# Altium schematic sheet 04_POWER.SchDoc: =TitleParameter
size A3; Project: HW_RYP_RADAR_R3; Organization: ASISGUARD; Address1: Kemalpasa, Kemalpasa Cd. No:290 D:292H, 35060 Bornova/Izmir/Turkey; SheetNumber: 4; SheetTotal: 8
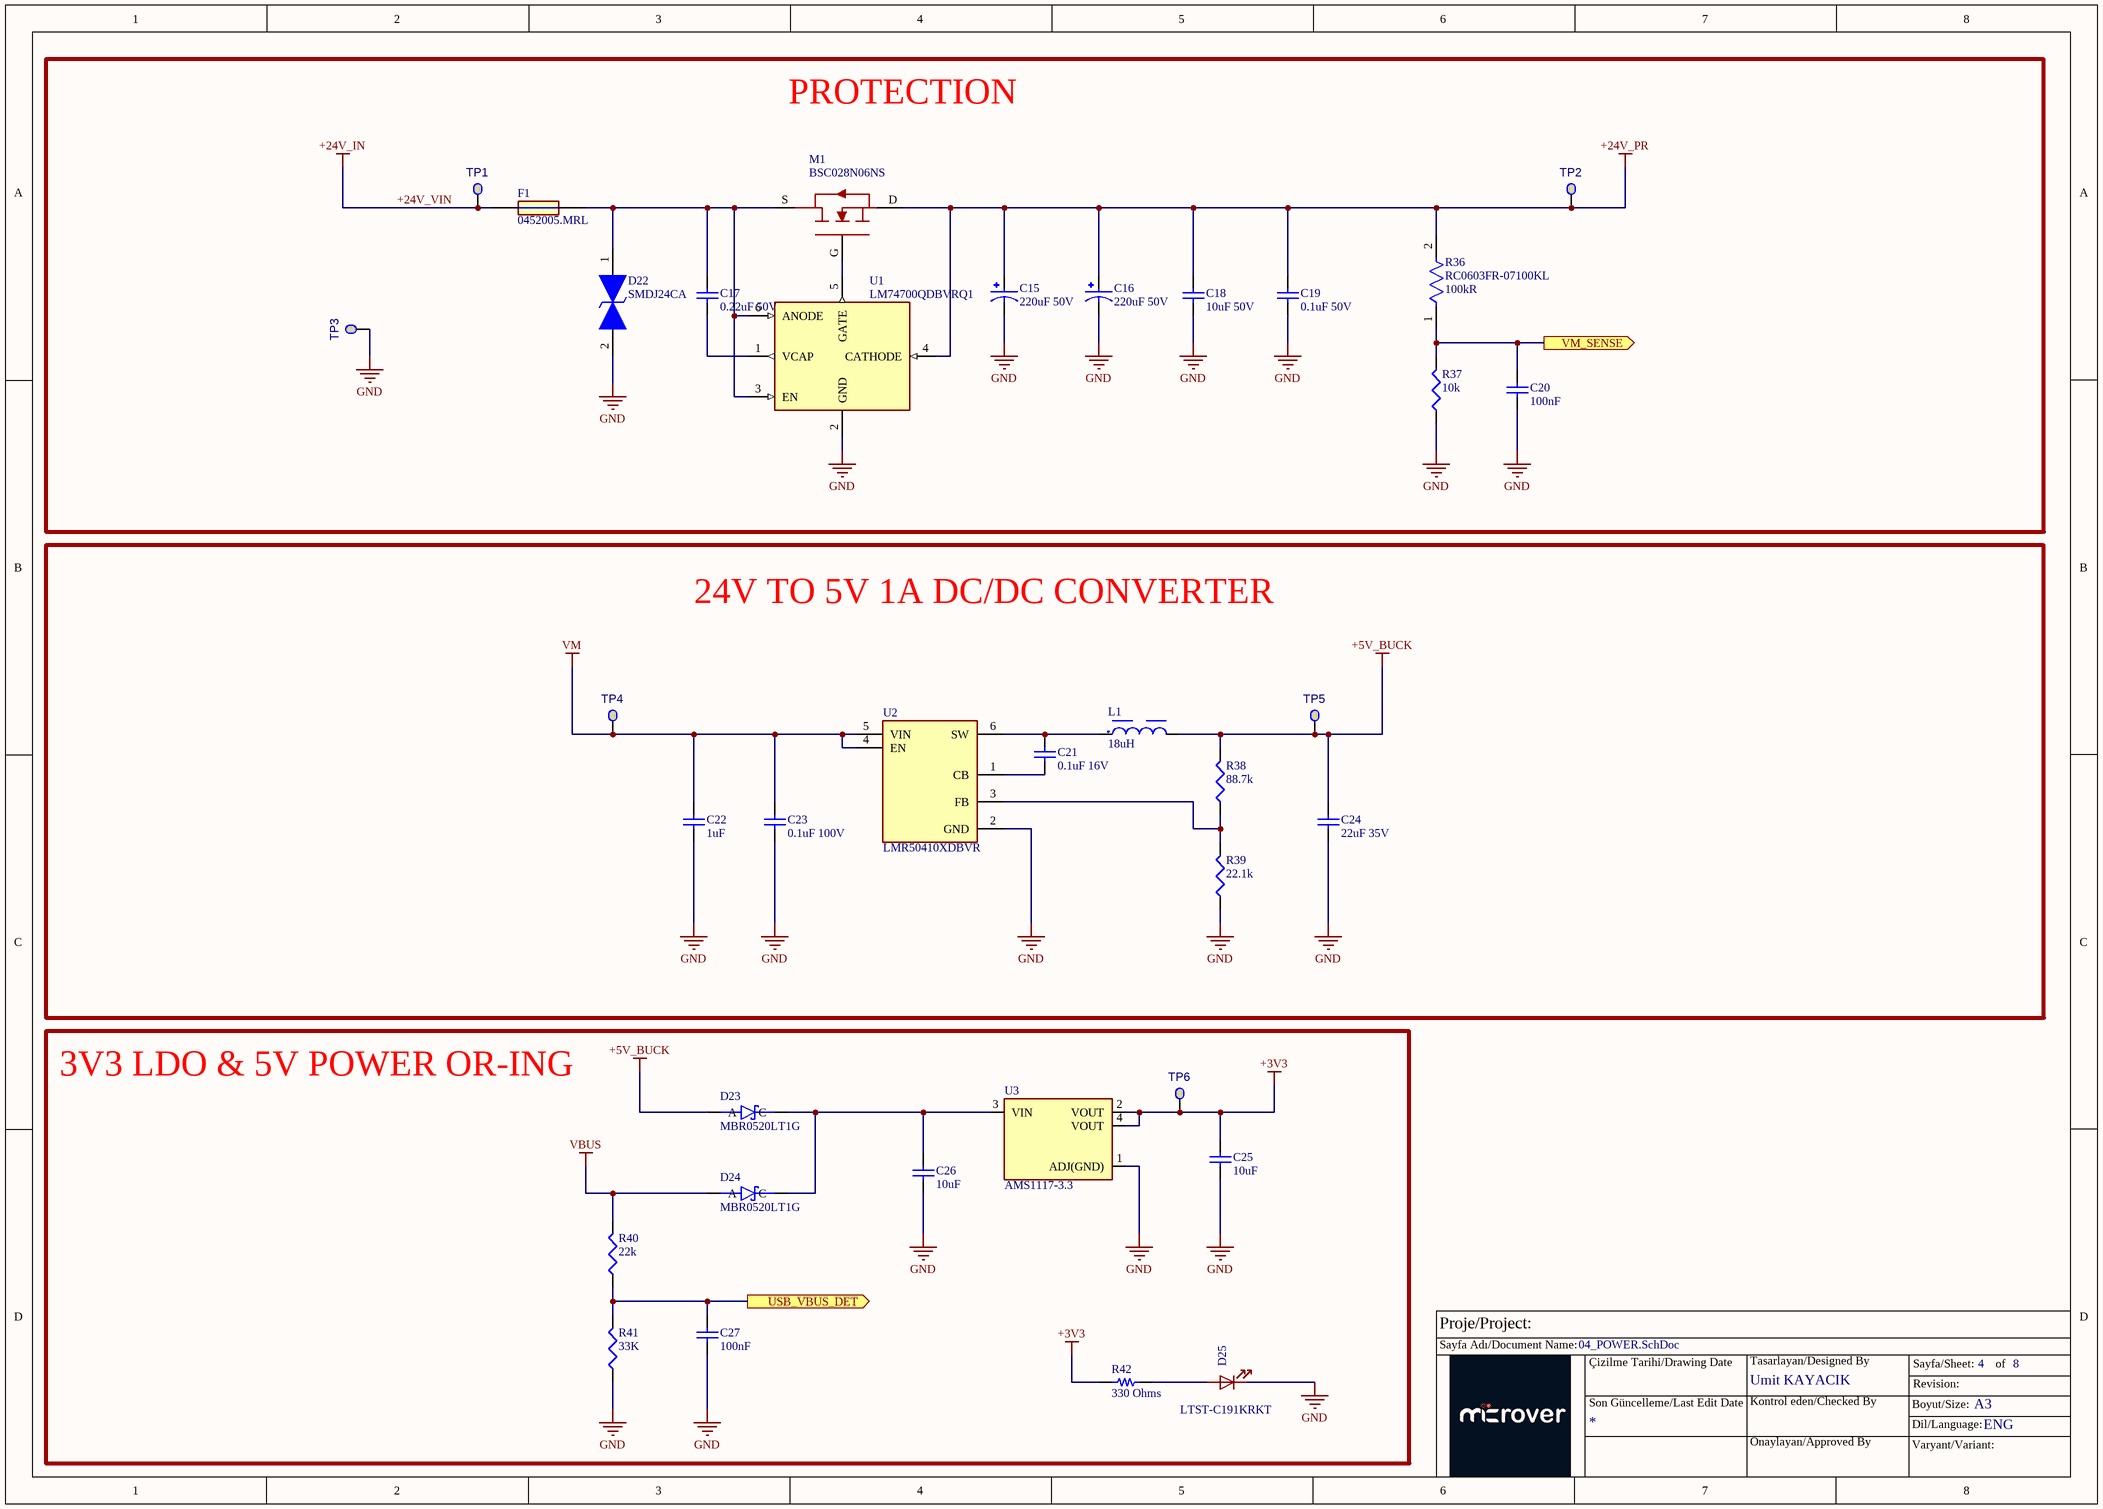
[diagram p0: 04_POWER.SchDoc]

## Parts
C15  220uF 50V  [CAP_EEEFT1H221AV]
C16  220uF 50V  [CAP_EEEFT1H221AV]
C17  value 0.22uF 50V  [SMC0603]  (hidden comment: CAP CER 0.22UF 50V X7R 0603)
C18  value 10uF 50V  [SMC1206]  (hidden comment: CAP CER 10UF 50V X5R 1206)
C19  value 0.1uF 50V  [SMC0603]  (hidden comment: CAP CER 0.1UF 50V X7R 0603)
C20  value 100nF  [CAP0603]  (hidden comment: 100nF 25V)
C21  0.1uF 16V  [CAP0603]
C22  1uF  [CAP0603]
C23  0.1uF 100V  [CAP0603]
C24  22uF 35V  [CAP1206]
C25  10uF  [CAP0603]
C26  10uF  [CAP0603]
C27  value 100nF  [CAP0603]  (hidden comment: 100nF 25V)
D22  SMDJ24CA  [DIONM9059X262N]
D23  MBR0520LT1G  [SOD3716X135N]
D24  MBR0520LT1G  [SOD3716X135N]
D25  LTST-C191KRKT  [LED0603]
F1  0452005.MRL  [FUSC6127X294N]
L1  18uH  [WE-LQS_6045]
M1  BSC028N06NS  [BSC028N06NS]
R36  RC0603FR-07100KL  Resistance: 100kR  [FP-RC0603-0_55-MFG]
R37  value 10k  [RES0603]  (hidden comment: RES 10K OHM 1% 1/8W 0603)
R38  88.7k  [RES0603]
R39  22.1k  [RES0603]
R40  value 22k  [SMR0603]  (hidden comment: RES 22K OHM 1% 1/10W 0603)
R41  value 33K  [SMR0603]  (hidden comment: RES 33K OHM 1% 1/10W 0603)
R42  330 Ohms  [RES 0603_1608]
TP1  Testpoint  [SMD_Ø1.5mm]  (value not drawn)  (no BOM)
TP2  Testpoint  [SMD_Ø1.5mm]  (value not drawn)  (no BOM)
TP3  Testpoint  [SMD_Ø1.5mm]  (value not drawn)  (no BOM)
TP4  Testpoint  [SMD_Ø1.5mm]  (value not drawn)  (no BOM)
TP5  Testpoint  [SMD_Ø1.5mm]  (value not drawn)  (no BOM)
TP6  Testpoint  [SMD_Ø1.5mm]  (value not drawn)  (no BOM)
U1  LM74700QDBVRQ1  [SOT95P280X145-6N/LM74700QDBVRQ1]
U2  LMR50410XDBVR  [SOT95P280X145-6N/]
U3  AMS1117-3.3  [SOT-223-4_L6.5-W3.5-P2.30-LS7.0-BR]

## Blocks framed on the sheet
PROTECTION: C15-C20 D22 F1 M1 R36 R37 TP1-TP3 U1
24V TO 5V 1A DC/DC CONVERTER: C21-C24 L1 R38 R39 TP4 TP5 U2
3V3 LDO & 5V POWER OR-ING: C25-C27 D23-D25 R40-R42 TP6 U3

## Ports
USB_VBUS_DET (out), VM_SENSE (out)

## Nets
+3V3: C25.2 R42.1 TP6.1(P1) U3.2(VOUT) U3.4(VOUT)
+5V_BUCK: C24.2 D23.A L1.2 R38.2 TP5.1(P1)
+24V_PR: C15.1 C16.1 C18.2 C19.2 M1.D R36.2 TP2.1(P1) U1.4(CATHODE)
+24V_VIN: F1.1 TP1.1(P1)  [also labelled +24V_IN]
GND: C15.2 C16.2 C18.1 C19.1 C20.1 C22.1 C23.1 C24.1 C25.1 C26.1 C27.1 D22.2 D25.2(K) R37.1 R39.1 R41.1 TP3.1(P1) U1.2(GND) U2.2(GND) U3.1(ADJ(GND))
VBUS: D24.A R40.2
VM: C22.2 C23.2 TP4.1(P1) U2.4(EN) U2.5(VIN)
USB_VBUS_DET: C27.2 R40.1 R41.2 ; port USB_VBUS_DET
VM_SENSE: C20.2 R36.1 R37.2 ; port VM_SENSE
NetC17_1: C17.1 U1.1(VCAP)
NetC17_2: C17.2 D22.1 F1.2 M1.S U1.3(EN) U1.6(ANODE)
NetC21_1: C21.1 U2.1(CB)
NetC21_2: C21.2 L1.1 U2.6(SW)
NetC26_2: C26.2 D23.C D24.C U3.3(VIN)
NetD25_1: D25.1(A) R42.2
NetM1_G: M1.G U1.5(GATE)
NetR38_1: R38.1 R39.2 U2.3(FB)

## Notes on the sheet
- Proje/Project:
- Sayfa Adı/Document Name:
- Çizilme Tarihi/Drawing Date
- Umit KAYACIK
- Tasarlayan/Designed By
- Sayfa/Sheet:
- Revision:
- of
- Son Güncelleme/Last Edit Date
- Kontrol eden/Checked By
- Onaylayan/Approved By
- Boyut/Size:
- Varyant/Variant:
- Dil/Language:
- A3
- ENG

## Library data of the parts
C15 C16 = EEEFT1H221AV: 220 µF 50 V Aluminum Electrolytic Capacitors Radial, Can - SMD 180mOhm @ 100kHz 2000 Hrs @ 105°C; Manufacturer Part Number: EEE-FT1H221AV; MF: Panasonic Electronic Components; Package: RADIAL-2 Panasonic; Price: None; Availability: In Stock; Value: *; Check_prices: https://www.snapeda.com/parts/EEE-FT1H221AV/Panasonic/view-part/5517810/?ref=eda; SnapEDA_Link: https://www.snapeda.com/parts/EEE-FT1H221AV/Panasonic/view-part/5517810/?ref=snap
C17 = CAP0603_0.22UF_50V: 0.22 µF ±10% 50V Ceramic Capacitor X7R 0603 (1608 Metric); Manufacturer Part Number: GCM188R71H224KA64D; Order Code: DIGI: 490-5402-2-ND
C18 = CAP1206_10UF_50V: 10 µF ±10% 50V Ceramic Capacitor X5R 1206 (3216 Metric); Manufacturer Part Number: CL31A106KBHNNNE; Order Code: Digi: 1276-2876-2-ND; Sirius Stock Code: *; LCSC Part Number: C13585; LCSC Manufacturer Part Number: CL31A106KBHNNNE
C19 = CAP0603_0.1UF_50V_2: 0.1 µF ±10% 50V Ceramic Capacitor X7R 0603 (1608 Metric); Manufacturer Part Number: CL10B104KB8NNNL; LCSC Manufacturer Part Number: CL10B104KB8NNNC; Order Code: DIGI:1276-CL10B104KB8NNNLTR-ND; Sirius Stock Code: A063-AGC10300001226; LCSC Part Number: C1591
C20 C27 = CAP0603_100nF: 0.1 µF ±10% 50V Ceramic Capacitor X7R 0603 (1608 Metric); Manufacturer Part Number: CL10B104KA8NNNC; LCSC Part Number: C1590
C21 = C0603C104M4RACTU: 0.1 µF ±20% 16V Ceramic Capacitor X7R 0603 (1608 Metric); Manifacturer: KEMET; Supplier: Digi; 399-C0603C104M4RACTUDKR-ND
C22 = MSASU168SB5105MTNA01: CAP CER 1UF 50V X5R 0603; Manufacturer: Taiyo Yuden; Supplier: 587-MSASU168SB5105MTNA01DKR-ND
C23 = GRM188R72A104KA35D: CAP CER 0.1UF 100V X7R 0603; Manifacturer: Murata Electronics; Supplier: Digi; 490-3285-6-ND
C24 = CAP1206_22uF_35V: 22 µF ±20% 35V Ceramic Capacitor X5R 1206 (3216 Metric); Manufacturer Part Number: C3216X5R1V226M160AC; Order Code: DIGI : 445-180362-1-ND; Value: 22uF 35V
C25 C26 = CAP0603_10uF_25V: 10 µF ±10% 25V Ceramic Capacitor X5R 0603 (1608 Metric); Manufacturer Part Number: GRM188R61E106KA73J; Order Code: Digi; 490-GRM188R61E106KA73JDKR-ND; Value: 10uF
D22 = SMDJ24CA: 38.9V Clamp 77.1A Ipp Tvs Diode Surface Mount DO-214AB (SMCJ); Manufacturer: Littelfuse Inc.; MPN: SMDJ24CA
D23 D24 = MBR0520LT1G: Diode 20 V 500mA Surface Mount SOD-123
D25 = LED_1: LED RED CLEAR SMD; Manufacturer: Lite-On Inc.; Value: LTST-C191KRKT; Footprint: LED_SMD:LED_0603_1608Metric; Manufacturer Part Number: LTST-C191KRKT; Supplier Part Number: 160-1447-1-ND
F1 = 0452005.MRL: FUSE BRD MNT 5A 125VAC/VDC 2SMD; Manufacturer: Littelfuse; Supplier: Digi; F2607DKR-ND
L1 = 74404064180: 18 µH Semi-Shielded Drum Core, Wirewound Inductor 2.2 A 81mOhm Nonstandard; Supplier: 732-5553-6-ND
M1 = BSC028N06NS: MOSFET'ler N-Ch 60V 100A TDSON-8 OptiMOS 3
R36 = CMP-2100-03662-2: RES SMD 100K OHM 1% 1/10W 0603; Voltage Rating (DC): 50V; Max Power Dissipation: 100mW; Temperature Coefficient: 100ppm/°C; Working Voltage: 75V; Length: 1.6mm; Lead Free: Lead Free; Number of Terminations: 2; Packaging: Tape and Reel; Voltage Rating: 50V; Termination: SMD/SMT; Width: 0.8mm; Resistor Type: Thick Film; Resistance Tolerance: 1%; Features: Moisture Resistant; Height: 0.45mm; Construction: Rectangular; Case/Package: 0603; Military Standard: Not; Case Code (Imperial): 0603; Series: RC; Technology: THICK FILM; Depth: 0.8mm; RoHS Compliant: Yes; REACH SVHC: No SVHC; Min Operating Temperature: -55°C; Case Code (Metric): 1608; Max Operating Temperature: 155°C; Power Rating: 100mW; Number of Pins: 2; Tolerance: 1%
R37 = RES0603_10K_%1_1: 10 kOhms ±1% 0.125W, 1/8W Chip Resistor 0603 (1608 Metric) Anti-Sulfur Thin Film; Manufacturer Part Number: RNCP0603FTD10K0; LCSC Manufacturer Part Number: MCT06030C1002FP500; Order Code: Digi: RNCP0603FTD10K0TR-ND; Sirius Stock Code: *; LCSC Part Number: C161803
R38 = CRCW060388K7FKEA: 88.7 kOhms ±1% 0.125W, 1/8W Chip Resistor 0603 (1608 Metric) Automotive AEC-Q200 Thick Film
R39 = RC0603FR-0722K1L: 22.1 kOhms ±1% 0.1W, 1/10W Chip Resistor 0603 (1608 Metric) Moisture Resistant Thick Film
R40 = RES0603_22K_%1: 10 kOhms ±1% 0.1W, 1/10W Chip Resistor 0603 (1608 Metric) Moisture Resistant Thick Film; Manufacturer Part Number: RC0603FR-0722KL; Order Code: Digi: 311-22.0KHRTR-ND; Sirius Stock Code: *; LCSC Part Number: C114065; LCSC Manufacturer Part Number: RC0603FR-0722KL
R41 = RES0603_33K_%1: 33 kOhms ±1% 0.1W, 1/10W Chip Resistor 0603 (1608 Metric) Moisture Resistant Thick Film; Manufacturer Part Number: RC0603FR-0733KL; Order Code: Digi: 311-33.0KHRTR-ND; Sirius Stock Code: *; LCSC Manufacturer Part Number: RC0603FR-0733KL; LCSC Part Number: C126359
R42 = CRGH0603F330R: RES SMD 330 OHM 1% 1/5W 0603; Manufacturer: TE Connectivity Passive Product; Power (Watts): 0.2W, 1/5W; Temperature Coefficient: ±100ppm/°C; Part Number: CRGH0603F330R; Value: 330 Ohms; ComponentLink1Description: Datasheet; ComponentLink1URL: https://www.te.com/commerce/DocumentDelivery/DDEController?Action=srchrtrv&DocNm=1773204-1&DocType=DS&DocLang=English; ComponentLink2Description: DigiKey Link; ComponentLink2URL: https://www.digikey.com/en/products/detail/te-connectivity-passive-product/CRGH0603F330R/5586961; Composition: Thick Film; Device Package: 0603 (1608 Metric); Height - Seated (Max): 0.022" (0.55mm); LastUpdated: 2/9/2024 8:43:33 PM; Lifecycle Status: Active; Minimum Order: 1; Number of Terminations: 2; Operating Temperature: -55°C ~ 155°C; Package / Case: 0603 (1608 Metric); Packaging: TapeAndReel; PartId: 5733; Part Status: Active; Price: 0.01; Resistance: 330 Ohms; Series: CRGH, Neohm; Size / Dimension: 0.063" L x 0.031" W (1.60mm x 0.80mm); Supplier 1: DigiKey; Supplier Part Number 1: A129541CT-ND; Supplier Device Package: 0603; Tolerance: ±1%
TP1-TP6 = TEST PAD SMT 10MIL X 20MIL: DNP: DNP; Value: Testpoint
U1 = LM74700QDBVRQ1: OR Controller N+1 ORing Controller N-Channel 1:1 SOT-23-6
U2 = LMR50410XDBVR: Buck Switching Regulator IC Positive Adjustable 1V 1 Output 1A SOT-23-6; Supplier: 296-LMR50410XDBVRDKR-ND; MPN: LMR50410XDBVR
U3 = AMS1117-3.3: Linear Voltage Regulator IC Positive Fixed 1 Output 1A SOT-223-3L; Manufacturer: UMW; Supplier: C347222